# EAGLE design controler (EAGLE 6.4)
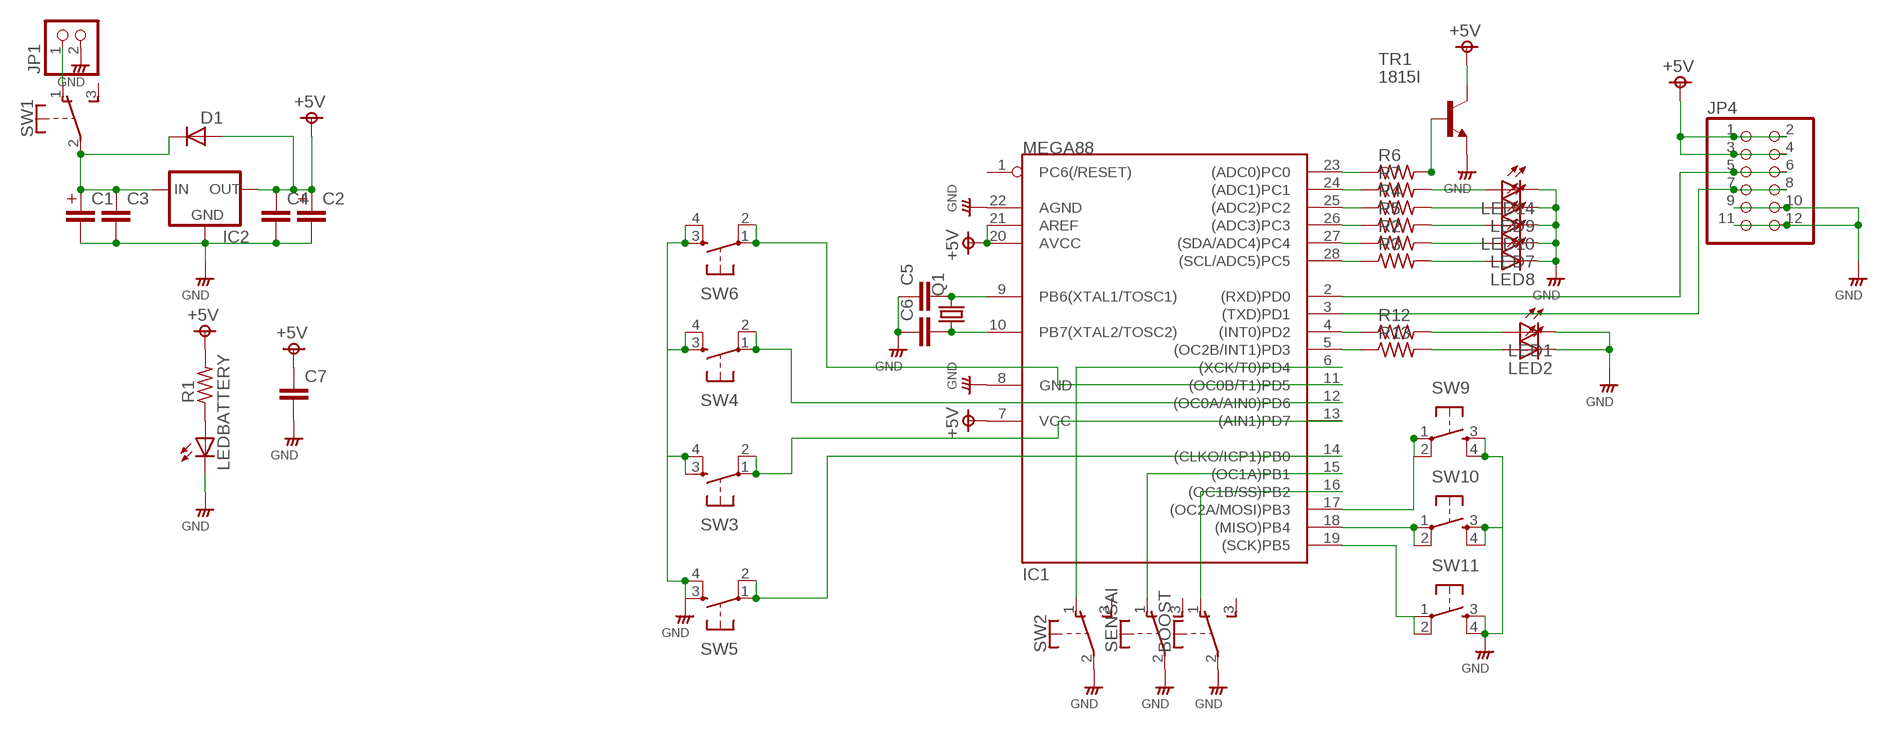
[diagram p0: schematic, sheet 1]

## Parts
BOOST  TOGGLE  [9450-2]
C1  CAPACITOR-330U  [C_330U]
C2  CAPACITOR-330U  [C_330U]
C3  MLCC-3  [MLCC_50]
C4  MLCC-3  [MLCC_50]
C5  MLCC-2  [MLCC_25]
C6  MLCC-2  [MLCC_25]
C7  MLCC-3  [MLCC_50]
D1  DIODE_3  [DIODE_3]
IC1  MEGA88  [DIL28-3]
IC2  78  [78XX]
JP1  PINHD-1X2"  [1*02]
JP4  PINHD-2X6  [2X06]
LED1  LED3MM  [LED3MM]
LED2  LED3MM  [LED3MM]
LED7  LED3MM  [LED3MM]
LED8  LED3MM  [LED3MM]
LED9  LED3MM  [LED3MM]
LED10  LED3MM  [LED3MM]
LED14  LED3MM  [LED3MM]
LEDBATTERY  LED5MM  [LED5MM]
Q1  CTYSTALHC49/S  [HC49/S]
R1  RESISTORS-2  [R_0.2]
R2  RESISTORS-1  [R_0.1]
R3  RESISTORS-1  [R_0.1]
R4  RESISTORS-1  [R_0.1]
R5  RESISTORS-1  [R_0.1]
R6  RESISTORS-2  [R_0.2]
R7  RESISTORS-1  [R_0.1]
R12  RESISTORS-1  [R_0.1]
R13  RESISTORS-1  [R_0.1]
SENSAI  TOGGLE  [9450-2]
SW1  TOGGLE  [9450-2]
SW2  TOGGLE  [9450-2]
SW3  TACT  [1273]
SW4  TACT  [1273]
SW5  TACT  [1273]
SW6  TACT  [1273]
SW9  TACT  [1273]
SW10  TACT  [1273]
SW11  TACT  [1273]
TR1  1815I  [TO92A]

## Nets
+5V: C2.P$1 C4.1 C7.1 D1.A IC1.7(VCC) IC1.20(AVCC) IC1.21(AREF) IC2.P$3(OUT) JP4.1 JP4.2 JP4.3 JP4.4 R1.2 TR1.C
GND: BOOST.2(P) C1.P$2 C2.P$2 C3.2 C4.2 C5.1 C6.1 C7.2 IC1.8(GND) IC1.22(AGND) IC2.P$2(GND) JP1.2 JP4.9 JP4.10 JP4.11 JP4.12 LED1.K(C) LED2.K(C) LED7.K(C) LED8.K(C) LED9.K(C) LED10.K(C) LED14.K(C) LEDBATTERY.K(C) SENSAI.2(P) SW2.2(P) SW3.3(S) SW3.4(S1) SW4.3(S) SW4.4(S1) SW5.3(S) SW5.4(S1) SW6.3(S) SW6.4(S1) SW9.3(S) SW9.4(S1) SW10.3(S) SW10.4(S1) SW11.3(S) SW11.4(S1) TR1.E
N$1: C5.2 IC1.9(PB6(XTAL1/TOSC1)) Q1.2
N$2: C6.2 IC1.10(PB7(XTAL2/TOSC2)) Q1.1
N$3: JP1.1 SW1.1(O)
N$4: IC1.4((INT0)PD2) R12.1
N$5: C1.P$1 C3.1 D1.C IC2.P$1(IN) SW1.2(P)
N$6: IC1.5((OC2B/INT1)PD3) R13.1
N$7: LED2.A R13.2
N$8: LED1.A R12.2
N$9: IC1.2((RXD)PD0) JP4.5 JP4.6
N$10: IC1.25((ADC2)PC2) R4.1
N$11: IC1.26((ADC3)PC3) R5.1
N$12: R6.2 TR1.B
N$13: IC1.23((ADC0)PC0) R6.1
N$14: IC1.3((TXD)PD1) JP4.7 JP4.8
N$15: IC1.27((SDA/ADC4)PC4) R2.1
N$16: IC1.28((SCL/ADC5)PC5) R3.1
N$18: IC1.24((ADC1)PC1) R7.1
N$19: IC1.6((XCK/T0)PD4) SW2.1(O)
N$20: IC1.11((OC0B/T1)PD5) SW6.1(P) SW6.2(P1)
N$22: IC1.12((OC0A/AIN0)PD6) SW4.1(P) SW4.2(P1)
N$23: IC1.13((AIN1)PD7) SW3.1(P) SW3.2(P1)
N$24: IC1.14((CLKO/ICP1)PB0) SW5.1(P) SW5.2(P1)
N$28: IC1.18((MISO)PB4) SW10.1(P) SW10.2(P1)
N$29: IC1.15((OC1A)PB1) SENSAI.1(O)
N$31: BOOST.1(O) IC1.16((OC1B/SS)PB2)
N$32: IC1.17((OC2A/MOSI)PB3) SW9.1(P) SW9.2(P1)
N$33: IC1.19((SCK)PB5) SW11.1(P) SW11.2(P1)
N$35: LED8.A R3.2
N$36: LED10.A R5.2
N$37: LED14.A R7.2
N$38: LED7.A R2.2
N$39: LED9.A R4.2
N$40: LEDBATTERY.A R1.1
Unconnected: BOOST.3(S) IC1.1(PC6(/RESET)) SENSAI.3(S) SW1.3(S) SW2.3(S)

## Library data of the parts
BOOST SENSAI SW1 SW2 = switch_s:TOGGLE
C1 C2 = rcl__s:CAPACITOR
C3-C7 = rcl__s:MLCC: CAPACITOR, European symbol
D1 = diode_s:DIODE
IC1 = avr_s:MEGA88: MICROCONTROLLER 8 Kbytes FLASH 1 kbytes SRAM 512 bytes EEPROM USART 4-channel 10 bit ADC 2-channel 8 bit ADC Source: avr.lbr
IC2 = regulator_s:78*: VOLTAGE REGULATOR
JP1 = pinhead_s:PINHD-1X2: PIN HEADER
JP4 = pinhead_s:PINHD-2X6: PIN HEADER
LED1 LED2 LED7-LED10 LED14 LEDBATTERY = LED_s:LED: LED OSRAM: - CHIPLED LG R971, LG N971, LY N971, LG Q971, LY Q971, LO R971, LY R971 LH N974, LH R974 LS Q976, LO Q976, LY Q976 LO Q996 - Hyper CHIPLED LW Q18S LB Q993, LB Q99A, LB R99A - SideLED LS A670, LO A670, LY A670, LG A670, LP A670 LB A673, LV A673, LT A673, LW A673 LH A674 LY A675 LS A676, LA A676, LO A676, LY A676, LW A676 LS A679, LY A679, LG A679 - Hyper Micro SIDELED® LS Y876, LA Y876, LO Y876, LY Y876 LT Y87S - SmartLED LW L88C, LW L88S LB L89C, LB L89S, LG L890 LS L89K, LO L89K, LY L89K LS L896, LA L896, LO L896, LY L896 - TOPLED LS T670, LO T670, LY T670, LG T670, LP T670 LSG T670, LSP T670, LSY T670, LOP T670, LYG T670 LG T671, LOG T671, LSG T671 LB T673, LV T673, LT T673, LW T673 LH T674 LS T676, LA T676, LO T676, LY T676, LB T676, LH T676, LSB T676, LW T676 LB T67C, LV T67C, LT T67C, LS T67K, LO T67K, LY T67K, LW E67C LS E67B, LA E67B, LO E67B, LY E67B, LB E67C, LV E67C, LT E67C LW T67C LS T679, LY T679, LG T679 LS T770, LO T770, LY T770, LG T770, LP T770 LB T773, LV T773, LT T773, LW T773 LH T774 LS E675, LA E675, LY E675, LS T675 LS T776, LA T776, LO T776, LY T776, LB T776 LHGB T686 LT T68C, LB T68C - Hyper Mini TOPLED® LB M676 - Mini TOPLED Santana® LG M470 LS M47K, LO M47K, LY M47K Source: http://www.osram.convergy.de - LUMILED® LXK2-PW12-R00, LXK2-PW12-S00, LXK2-PW14-U00, LXK2-PW14-V00 LXK2-PM12-R00, LXK2-PM12-S00, LXK2-PM14-U00 LXK2-PE12-Q00, LXK2-PE12-R00, LXK2-PE12-S00, LXK2-PE14-T00, LXK2-PE14-U00 LXK2-PB12-K00, LXK2-PB12-L00, LXK2-PB12-M00, LXK2-PB14-N00, LXK2-PB14-P00, LXK2-PB14-Q00 LXK2-PR12-L00, LXK2-PR12-M00, LXK2-PR14-Q00, LXK2-PR14-R00 LXK2-PD12-Q00, LXK2-PD12-R00, LXK2-PD12-S00 LXK2-PH12-R00, LXK2-PH12-S00 LXK2-PL12-P00, LXK2-PL12-Q00, LXK2-PL12-R00 Source: www.luxeon.com
Q1 = crystal_s:CTYSTAL: CRYSTAL
R1-R7 R12 R13 = rcl__s:RESISTORS
SW3-SW6 SW9-SW11 = switch_s:TACT: OMRON SWITCH
TR1 = transistor_s:1815: NPN Transistor

## Board
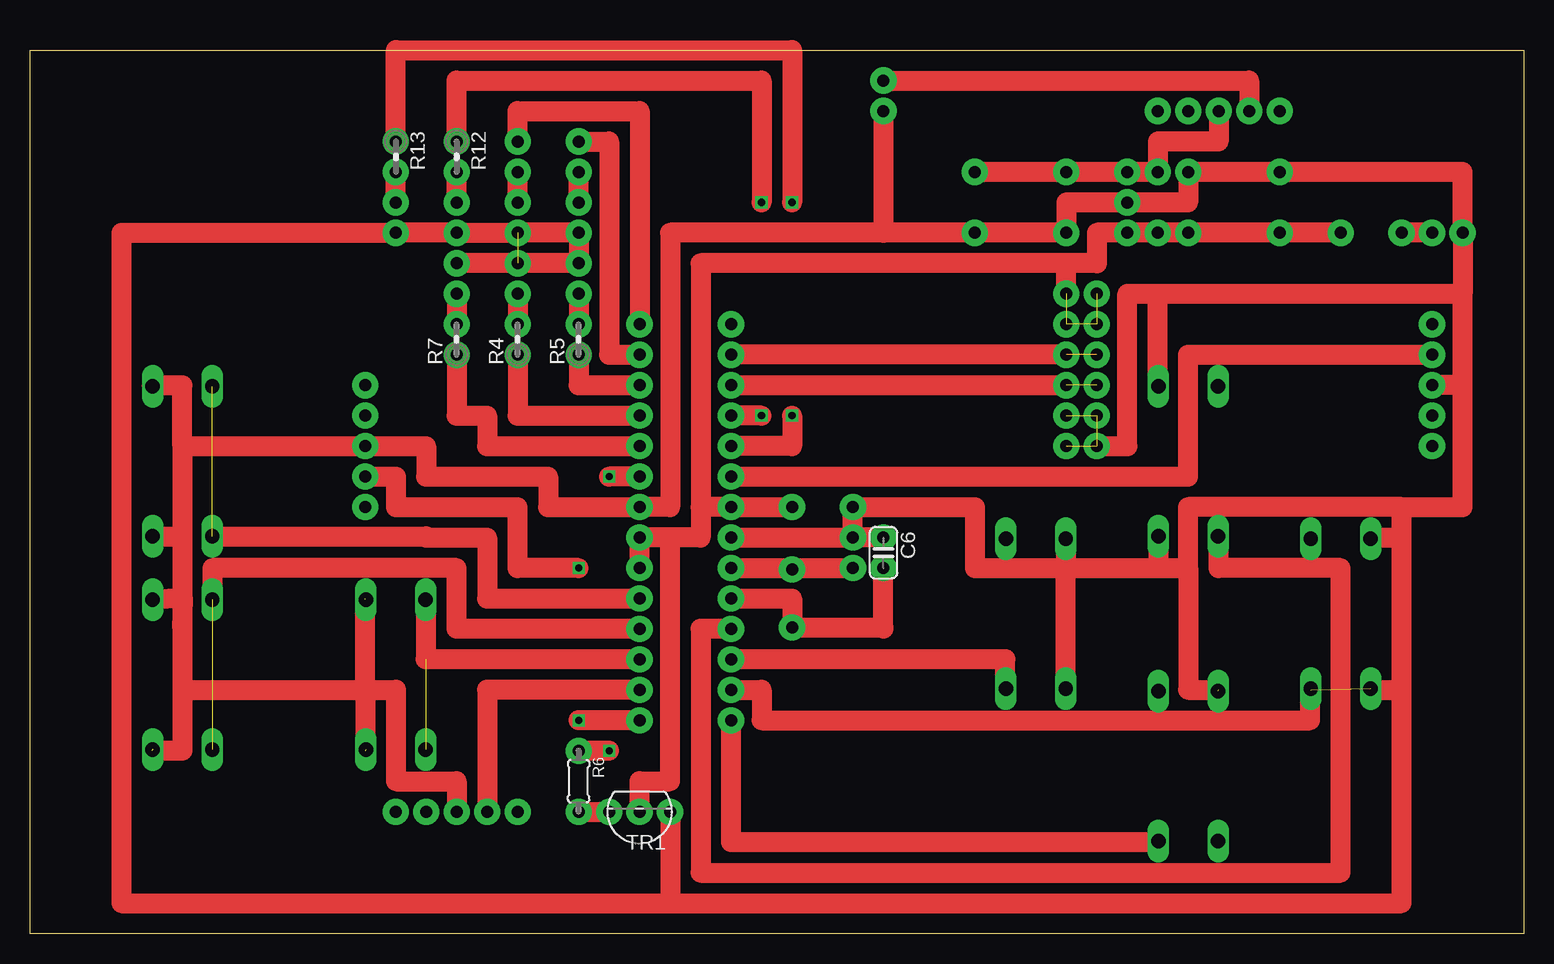
[diagram p1: board, top side]
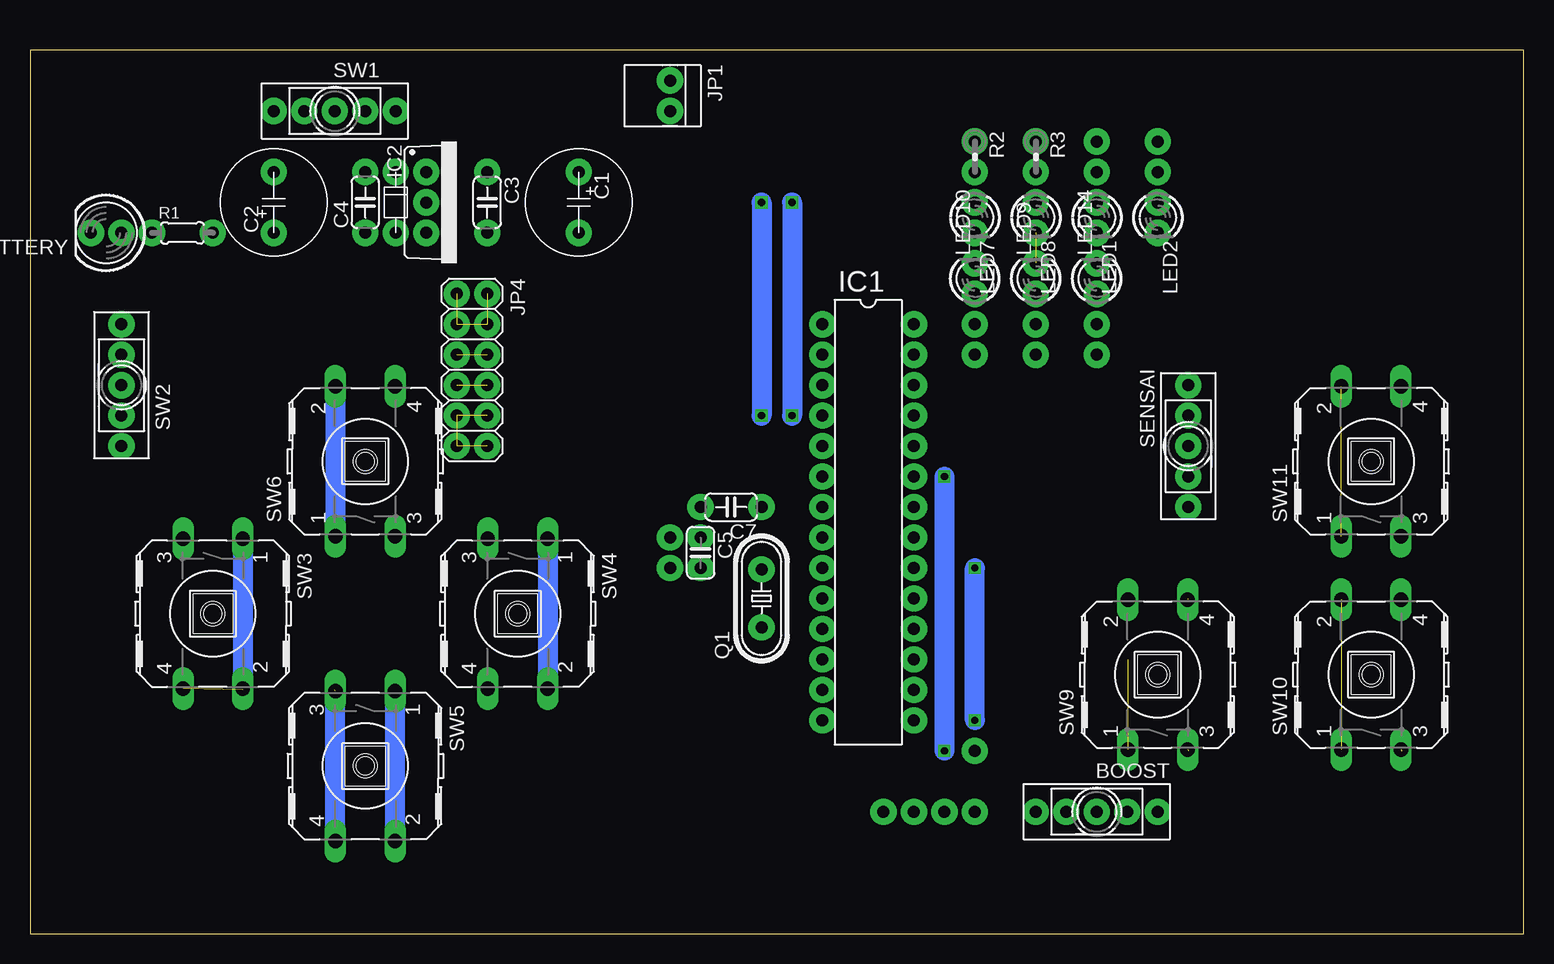
[diagram p2: board, bottom side, seen from below]

Size 124.46 x 73.66 mm. Coordinates in mm from the lower left corner, seen from the top.
Outline: 124.46,0 0,0 0,73.66 124.46,73.66 124.46,0
Copper layers (1*16): Top 0.035mm / dielectric 1.5mm / Bottom 0.035mm
Design rules "default": minimum track width 10mil, minimum drill 24mil, track to track 8mil, track to pad 8mil, pad to pad 8mil, via to via 8mil, smd to smd 8mil, copper to edge 40mil, drill to drill 8mil, minimum pad ring 10mil, minimum via ring 8mil, stop-mask expansion 4mil, vias tented up to drill 0mil, thermal gap 10mil

### Footprints (pad centres in the part's own frame; a part is rotated, then mirrored left to right if it is on the bottom)
9450-2 = drill 1 pad 2.184: 1 -2.54,0; 2 0,0; 3 2.54,0; F1 -5.08,0; F2 5.08,0
C_330U = drill 1 pad 2.184: P$1 -2.54,0; P$2 2.54,0
MLCC_50 = drill 1 pad 2.184: 1 -2.54,0; 2 2.54,0
MLCC_25 = drill 1 pad 2.184: 1 -1.27,0; 2 1.27,0
DIODE_3 = drill 1 pad 2.184: A -2.54,0; C 2.54,0
DIL28-3 = drill 1 pad 2.184: 1 -3.81,16.51; 2 -3.81,13.97; 3 -3.81,11.43; 4 -3.81,8.89; 5 -3.81,6.35; 6 -3.81,3.81; 7 -3.81,1.27; 8 -3.81,-1.27; 9 -3.81,-3.81; 10 -3.81,-6.35; 11 -3.81,-8.89; 12 -3.81,-11.43; 13 -3.81,-13.97; 14 -3.81,-16.51; 15 3.81,-16.51; 16 3.81,-13.97; 17 3.81,-11.43; 18 3.81,-8.89; 19 3.81,-6.35; 20 3.81,-3.81; 21 3.81,-1.27; 22 3.81,1.27; 23 3.81,3.81; 24 3.81,6.35; 25 3.81,8.89; 26 3.81,11.43; 27 3.81,13.97; 28 3.81,16.51
78XX = drill 1 pad 2.184: P$1 -2.54,0; P$2 0,0; P$3 2.54,0
1*02 = drill 1 pad 2.184: 1 -1.27,0; 2 1.27,0
2X06 = drill 1 pad 2.184: 1 -6.35,-1.27; 2 -6.35,1.27; 3 -3.81,-1.27; 4 -3.81,1.27; 5 -1.27,-1.27; 6 -1.27,1.27; 7 1.27,-1.27; 8 1.27,1.27; 9 3.81,-1.27; 10 3.81,1.27; 11 6.35,-1.27; 12 6.35,1.27
LED3MM = drill 1 pad 2.184: A -1.27,0; K 1.27,0
LED5MM = drill 1 pad 2.184: A -1.27,0; K 1.27,0
HC49/S = drill 1 pad 2.184: 1 -2.413,0; 2 2.413,0
R_0.2 = drill 1 pad 2.184: 1 -2.54,0; 2 2.54,0
R_0.1 = drill 1 pad 2.184: 1 -1.27,0; 2 1.27,0
1273 = drill 1.194 long: 1 -6.248,2.489; 2 6.248,2.489; 3 -6.248,-2.489; 4 6.248,-2.489
TO92A = drill 1 pad 2.184: B 2.54,0; C 0,0; E -2.54,0

### Placement (x,y rotation side)
BOOST  35.56,10.16 0 bottom
C1  78.74,60.96 270 bottom
C2  104.14,60.96 90 bottom
C3  86.36,60.96 270 bottom
C4  96.52,60.96 90 bottom
C5  68.58,31.75 270 bottom
C6  71.12,31.75 270 top
C7  66.04,35.56 180 bottom
D1  93.98,60.96 90 bottom
IC1  54.61,34.29 0 bottom
IC2  91.44,60.96 270 bottom
JP1  71.12,69.85 270 bottom
JP4  87.63,46.99 270 bottom
LED1  35.56,59.69 270 bottom
LED2  30.48,59.69 270 bottom
LED7  45.72,59.69 270 bottom
LED8  40.64,59.69 270 bottom
LED9  40.64,54.61 90 bottom
LED10  45.72,54.61 90 bottom
LED14  35.56,54.61 90 bottom
LEDBATTERY  118.11,58.42 180 bottom
Q1  63.5,27.94 90 bottom
R1  111.76,58.42 0 bottom
R2  45.72,64.77 270 bottom
R3  40.64,64.77 270 bottom
R4  40.64,49.53 90 top
R5  45.72,49.53 90 top
R6  45.72,12.7 270 top
R7  35.56,49.53 90 top
R12  35.56,64.77 270 top
R13  30.48,64.77 270 top
SENSAI  27.94,40.64 90 bottom
SW1  99.06,68.58 0 bottom
SW2  116.84,45.72 270 bottom
SW3  109.22,26.67 270 bottom
SW4  83.82,26.67 270 bottom
SW5  96.52,13.97 270 bottom
SW6  96.52,39.37 90 bottom
SW9  30.48,21.59 90 bottom
SW10  12.7,21.59 90 bottom
SW11  12.7,39.37 90 bottom
TR1  50.8,10.16 180 top

### Tracks (layer width: path | path; a pad name or v marks a point on that pad's centre or on a via)
+5V  (3 unrouted)
  Top 1.676: IC1.20 IC1.21 53.34,33.02 | C7.1 IC1.7 55.88,35.56 | R1.2 C2.P$1 C4.1 D1.A IC2.P$3 88.9,58.42 88.9,55.88 86.36,55.88 | 55.88,35.56 55.88,33.02 53.34,33.02 | 86.36,55.88 55.88,55.88 55.88,35.56 | JP4.2 86.36,55.88 | TR1.C 50.8,12.7 53.34,12.7 53.34,33.02
GND  (9 unrouted)
  Top 1.676: IC1.8 C5.1 | C5.1 C7.2 78.74,35.56 78.74,30.48 86.31,30.48 | C6.1 C5.1 | 119.38,53.34 LEDBATTERY.K 119.38,63.5 C2.P$2 C4.2 96.52,60.96 IC2.P$2 86.36,60.96 C3.2 C1.P$2 71.12,58.42 | 71.12,58.42 53.34,58.42 53.34,35.56 IC1.22 43.18,35.56 43.18,38.1 33.02,38.1 33.02,40.64 SENSAI.2 12.7,40.64 | LED14.K LED10.K LED7.K LED8.K LED1.K LED2.K 7.62,58.42 7.62,2.54 53.34,2.54 | 53.34,2.54 114.3,2.54 114.3,20.32 | 114.3,20.32 114.3,33.02 | 114.3,33.02 114.3,35.56 | 114.3,35.56 119.38,35.56 119.38,45.72 | 114.3,35.56 96.52,35.56 96.52,30.48 | 12.7,40.64 12.7,33.12 | 12.7,33.12 12.7,25.4 | 86.31,30.48 94.03,30.48 | 94.03,30.48 96.52,30.48 | JP4.11 91.44,40.64 91.44,53.34 93.98,53.34 | 93.98,53.34 119.38,53.34 | SW3.4 111.71,20.32 114.3,20.32 | SW3.3 111.71,33.02 114.3,33.02 | SW4.4 86.31,30.48 | SW4.3 86.31,30.48 | SW6.3 94.03,30.48 | 12.7,25.4 12.75,27.94 SW10.4 | SW9.4 27.94,27.84 | 12.7,25.4 12.7,20.32 | 12.7,20.32 27.94,20.32 | 27.94,20.32 27.94,15.24 | 27.94,20.32 30.48,20.32 30.48,12.7 35.56,12.7 BOOST.2 | 96.52,30.48 96.52,20.32 99.06,20.32 | 27.94,20.32 27.94,27.94 | 12.7,20.32 12.7,15.24 10.16,15.24 | 12.7,40.64 12.7,45.72 10.16,45.72 10.16,45.62 SW11.4 | SW11.3 12.7,33.12 | SW6.4 93.98,45.62 93.98,53.34 | 119.38,45.72 119.38,53.34 | 119.38,45.72 SW2.2 | JP1.2 71.12,58.42 | TR1.E 53.34,2.54
  Bottom 1.676: 106.73,20.32 106.68,20.32 | SW5.4 SW5.3
N$1
  Top 0.406: Q1.2 60.96,30.35 60.96,30.48
  Top 1.676: IC1.9 60.96,30.48 C5.2
N$2
  Top 1.676: IC1.10 63.5,27.94 Q1.1 71.12,25.53 | 71.12,25.53 71.12,25.4 | 71.12,25.53 C6.2
N$3
  Top 1.676: SW1.1 101.6,71.12 JP1.1
N$4  (via drill 0.6)
  Top 1.676: R12.1 35.56,71.12 60.96,71.12 v60.96,60.96 | v60.96,43.18 IC1.4
  Bottom 1.676: v60.96,60.96 v60.96,43.18
N$5
  Top 1.676: SW1.2 99.06,66.04 93.98,66.04 D1.C IC2.P$1 C3.1 C1.P$1
N$6  (via drill 0.6)
  Top 1.676: R13.1 30.48,73.66 63.5,73.66 v63.5,60.96 | v63.5,43.18 63.5,40.64 IC1.5
  Bottom 1.676: v63.5,60.96 v63.5,43.18
N$7
  Top 1.676: LED2.A R13.2
N$8
  Top 1.676: LED1.A R12.2
N$9  (1 unrouted)
  Top 1.676: JP4.6 IC1.2
N$10
  Top 1.676: IC1.25 40.64,43.18 R4.1
N$11
  Top 1.676: R5.1 45.72,45.72 IC1.26
N$12
  Top 1.676: R6.2 TR1.B
N$13  (via drill 0.6)
  Top 1.676: IC1.23 v48.26,38.1 | v48.26,15.24 R6.1
  Bottom 1.676: v48.26,38.1 v48.26,15.24
N$14  (1 unrouted)
  Top 1.676: IC1.3 JP4.8
N$15
  Top 1.676: R2.1 48.26,66.04 48.26,48.26 IC1.27
N$16
  Top 1.676: R3.1 40.64,68.58 50.8,68.58 IC1.28
N$18
  Top 1.676: R7.1 35.56,43.18 38.1,43.18 38.1,40.64 IC1.24
N$19
  Top 1.676: IC1.6 96.52,38.1 96.52,48.26 SW2.1
N$20
  Top 1.676: IC1.11 55.88,25.4 55.88,5.08 109.22,5.08 109.22,30.48 99.06,30.48 99.06,33.12 SW6.1
  Bottom 1.676: SW6.2 SW6.1
N$22
  Top 1.676: SW4.2 81.33,20.32 81.28,20.32 81.28,22.86 IC1.12
  Bottom 1.676: SW4.1 SW4.2
N$23
  Top 1.676: IC1.13 60.96,20.32 60.96,17.78 106.68,17.78 106.68,20.42 SW3.2
  Bottom 1.676: SW3.1 SW3.2
N$24
  Top 1.676: SW5.2 94.03,7.62 58.42,7.62 IC1.14
  Bottom 1.676: SW5.2 SW5.1
N$28  (1 unrouted)
  Top 1.676: IC1.18 35.56,25.4 35.56,30.48 15.19,30.48 SW10.2
N$29  (via drill 0.6)
  Top 1.676: SENSAI.1 30.48,38.1 30.48,35.56 40.64,35.56 40.64,30.48 v45.72,30.48 | IC1.15 v45.72,17.78
  Bottom 1.676: v45.72,17.78 v45.72,30.48
N$31
  Top 1.676: IC1.16 38.1,20.32 BOOST.1
N$32  (1 unrouted)
  Top 1.676: SW9.2 32.97,22.86 IC1.17
N$33  (1 unrouted)
  Top 1.676: SW11.1 15.24,33.02 15.24,33.12 33.02,33.12 33.02,33.02 38.1,33.02 38.1,27.94 IC1.19
N$35
  Top 1.676: LED8.A R3.2
N$36
  Top 1.676: LED10.A R5.2
N$37
  Top 1.676: LED14.A R7.2
N$38
  Top 1.676: LED7.A R2.2
N$39
  Top 1.676: LED9.A R4.2
N$40
  Top 1.676: LEDBATTERY.A R1.1